# Altium schematic sheet RS232.SchDoc: RS232
size A4; DocumentNumber: MB1219; Revision: B.1; SheetNumber: 10; SheetTotal: 17; Project: STM32F769I-EVAL
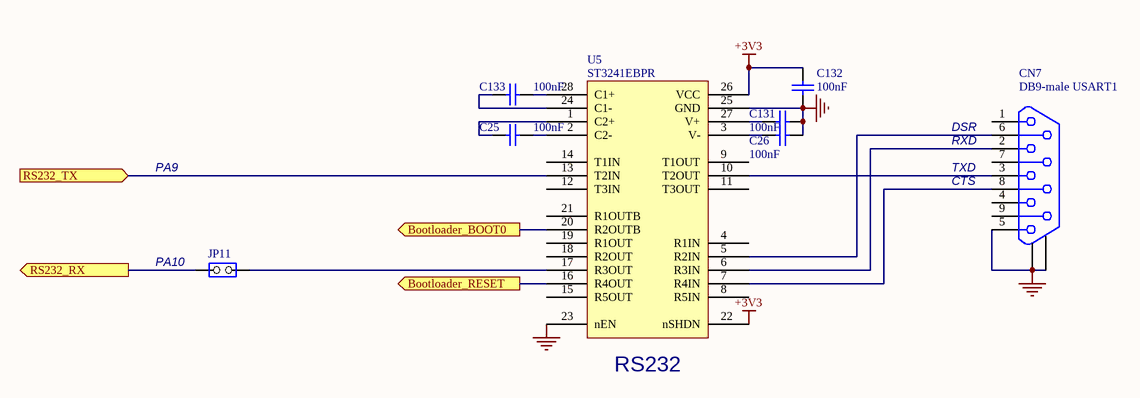
[diagram p0: RS232.SchDoc]

## Parts
C25  100nF  [0603C]
C26  100nF  [0603C]
C131  100nF  [0603C]
C132  100nF  [0603C]
C133  100nF  [0603C]
CN7  DB9-male USART1  [DB9/M]
JP11  (no value)  [SIP2]
U5  ST3241EBPR  [SSOP28_0R65_10R2X7R8]

## Ports
Bootloader_BOOT0 (out), Bootloader_RESET (out), RS232_RX (out), RS232_TX (in)

## Nets
+3V3: C132.1 U5.22(nSHDN) U5.26(VCC)
GND: C26.1 C131.1 C132.2 CN7.5 CN7.10 CN7.11 U5.23(nEN) U5.25(GND)
Bootloader_BOOT0: U5.20(R2OUTB) ; port Bootloader_BOOT0
Bootloader_RESET: U5.16(R4OUT) ; port Bootloader_RESET
RS232_RX: JP11.1(COMMON) ; port RS232_RX
RS232_TX: U5.13(T2IN) ; port RS232_TX
NetC25_1: C25.1 U5.1(C2+)
NetC25_2: C25.2 U5.2(C2-)
NetC26_2: C26.2 U5.3(V-)
NetC131_2: C131.2 U5.27(V+)
NetC133_1: C133.1 U5.24(C1-)
NetC133_2: C133.2 U5.28(C1+)
NetCN7_2: CN7.2 U5.6(R3IN)
NetCN7_3: CN7.3 U5.10(T2OUT)
NetCN7_6: CN7.6 U5.5(R2IN)
NetCN7_8: CN7.8 U5.7(R4IN)
NetJP11_2: JP11.2(NO) U5.17(R3OUT)

Not connected (* = marked no-connect by the designer): CN7 1 4 7 9; U5 4(R1IN) 8(R5IN) 9(T1OUT) 11(T3OUT) 12(T3IN) 14(T1IN) 15(R5OUT) 18(R2OUT) 19(R1OUT) 21(R1OUTB)

## Notes on the sheet
- (near CN7) RXD
- (near CN7) DSR
- PA9
- (near CN7) TXD
- (near CN7) CTS
- (near JP11) PA10
- (near U5) RS232
- Title:
- Project:
- Size:
- Date:
- A4
- Reference:
- Sheet:
- Revision:
- of

## Library data of the parts
C25 C26 C131-C133 = Cap: Capacitor; Value: 10nF; Published: 8-Jun-2000; Revision: July-2002: Re-released for DXP Platform.; Publisher: Altium Limited
CN7 = DB9-USART
JP11 = JP2: Ordered by: Subcon; Silkscreen: Pwr_ext